# Altium schematic sheet DF_ESC_rev01_1.SchDoc: DF_ESC_rev01_1
size 297 x 209 mm; Engineer: Aleksandr Sereda; Revision: 01_1; SheetNumber: 1; SheetTotal: 11; Email: avsjob000@gmail.com
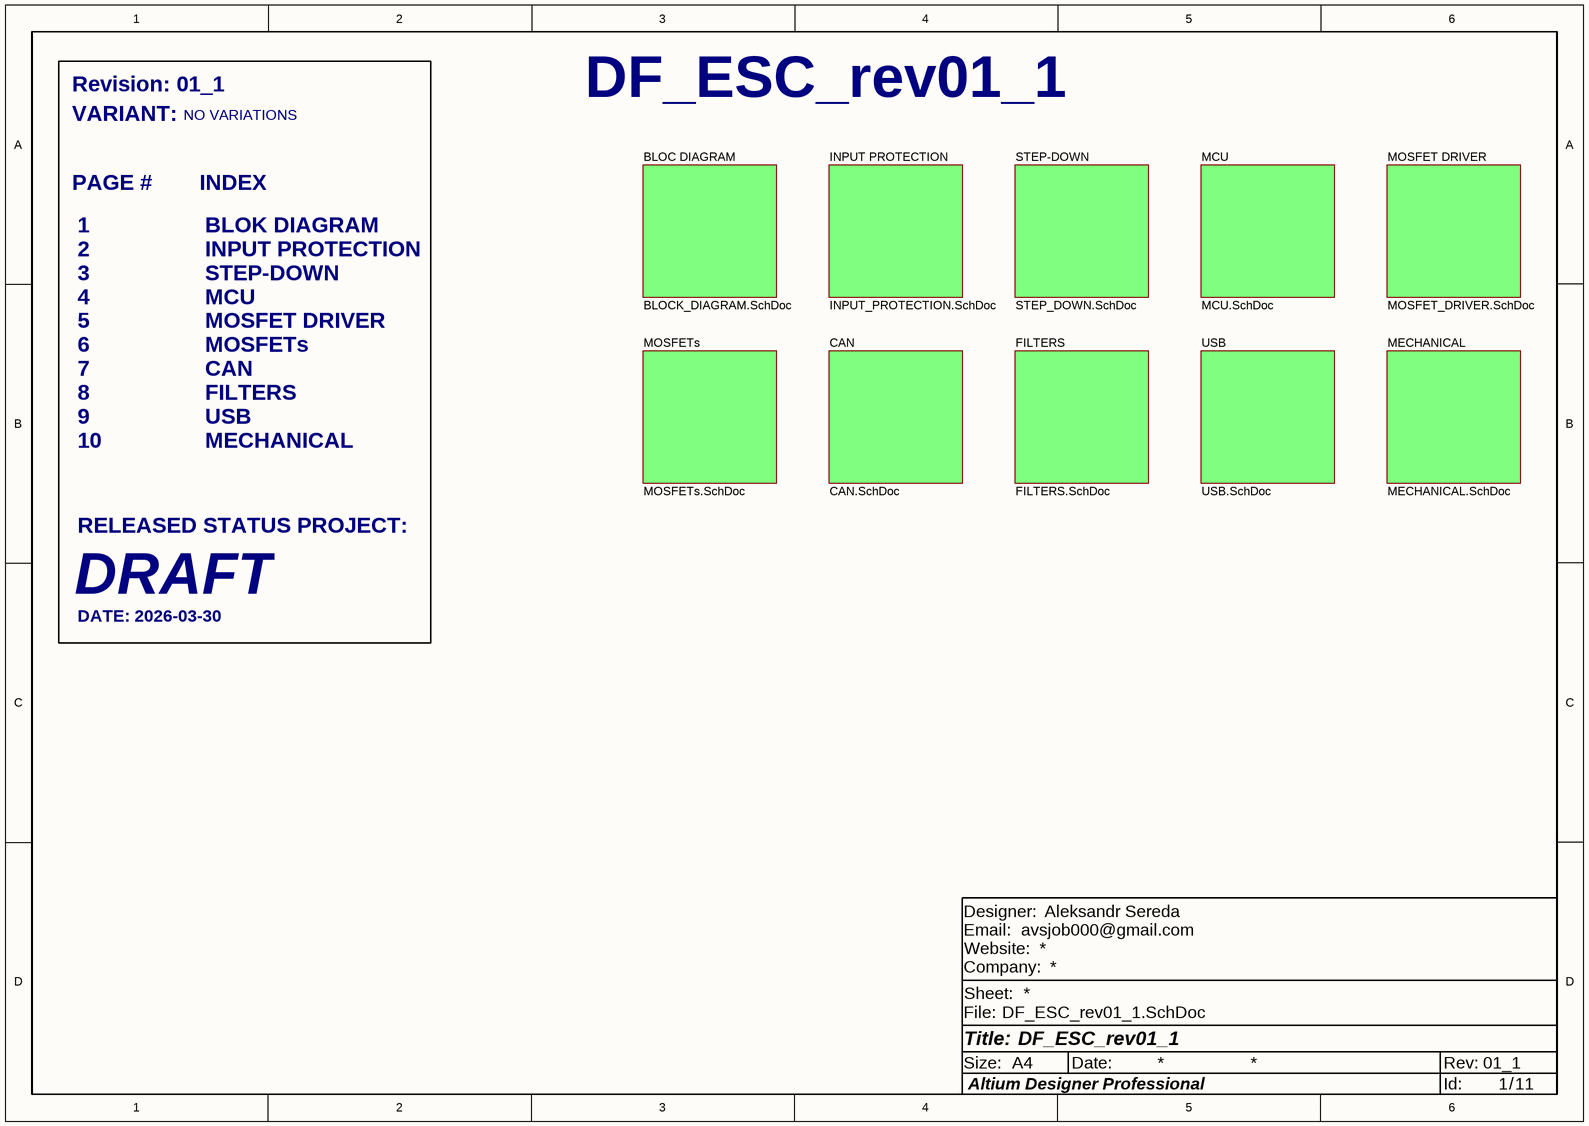
[diagram p0: DF_ESC_rev01_1.SchDoc]

## Sub-sheets
BLOC DIAGRAM = BLOCK_DIAGRAM.SchDoc: no entries
CAN = CAN.SchDoc: no entries
FILTERS = FILTERS.SchDoc: no entries
INPUT PROTECTION = INPUT_PROTECTION.SchDoc: no entries
MCU = MCU.SchDoc: no entries
MECHANICAL = MECHANICAL.SchDoc: no entries
MOSFET DRIVER = MOSFET_DRIVER.SchDoc: no entries
MOSFETs = MOSFETs.SchDoc: no entries
STEP-DOWN = STEP_DOWN.SchDoc: no entries
USB = USB.SchDoc: no entries

## Notes on the sheet
- Revision: 01_1
- VARIANT:
- NO VARIATIONS
- DF_ESC_rev01_1
- PAGE #
- INDEX
- 1
- 2
- BLOK DIAGRAM
- INPUT PROTECTION
- 3
- 4
- 5
- STEP-DOWN
- MCU
- MOSFET DRIVER
- 6
- 7
- 8
- MOSFETs
- CAN
- FILTERS
- 9
- 10
- USB
- MECHANICAL
- RELEASED STATUS PROJECT:
- DRAFT
- DATE: 2026-03-30
- Email:
- Website:
- Designer:
- File:
- Sheet:
- Company:
- Size:
- Title:
- A4
- Altium Designer Professional
- Date:
- Id:
- Rev:
- /